# Altium schematic sheet 10_RS232_1.SchDoc
size A3
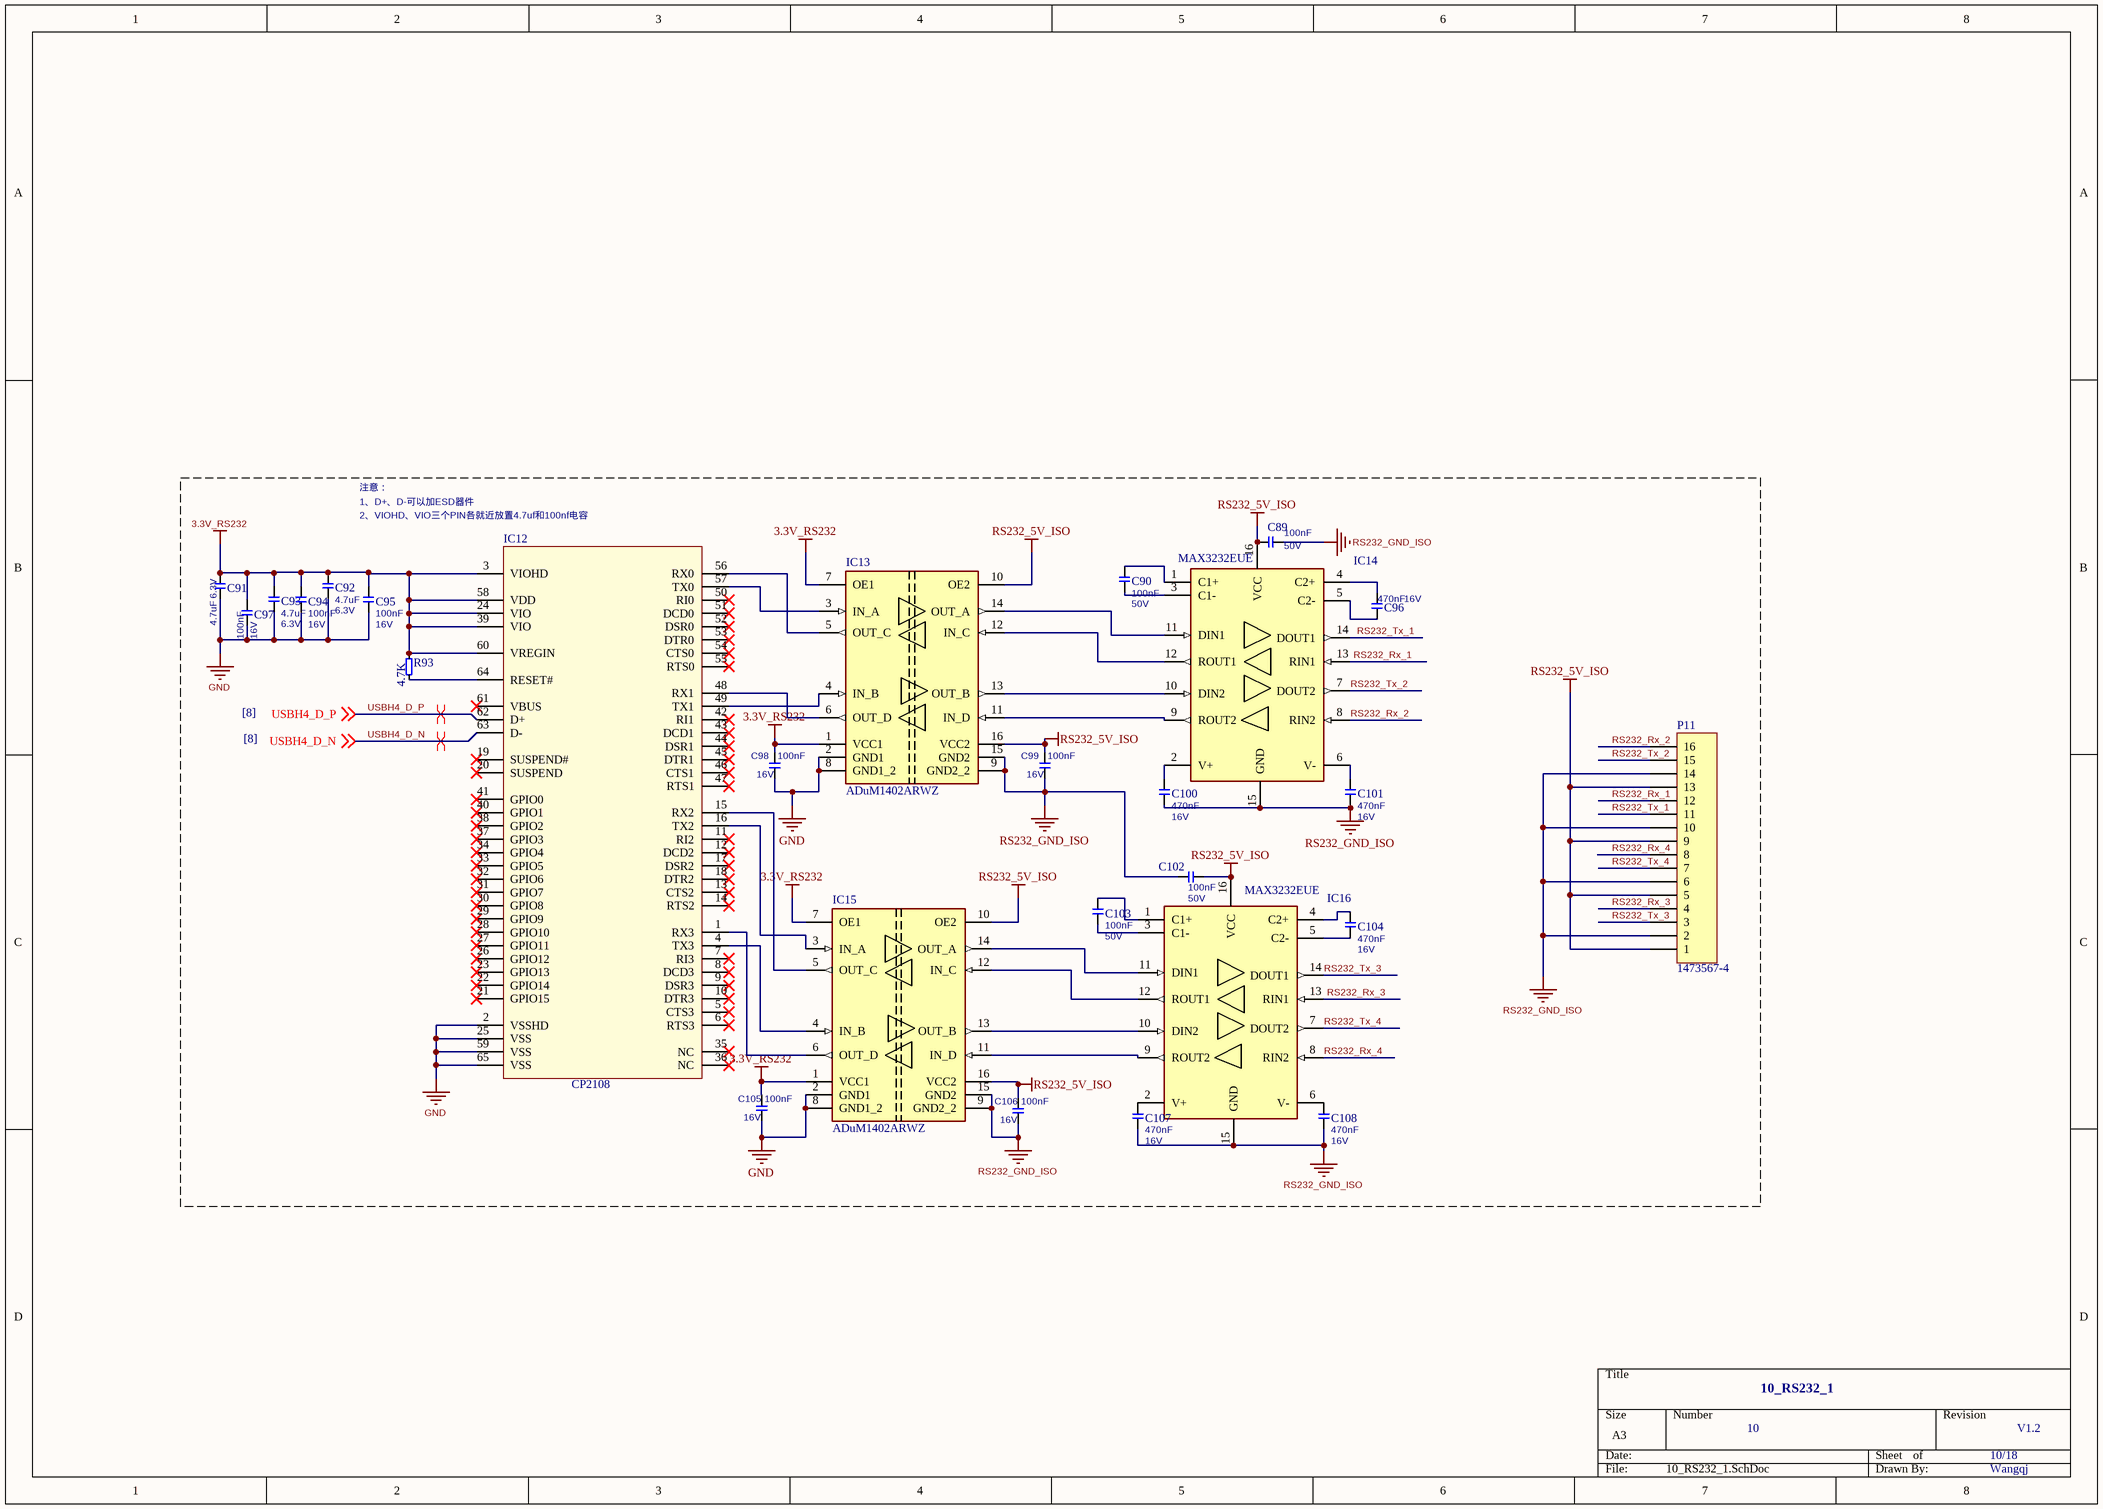
[diagram p0: 10_RS232_1.SchDoc]

## Parts
C89  Rating: 50V  [T_CAPC0603X33N]  (hidden comment: 100nF)
C90  Rating: 50V  [T_CAPC0603X33N]  (hidden comment: 100nF)
C91  Rating: 6.3V  [T_CAPC0603X33N]  (hidden comment: 4.7uF)
C92  Rating: 6.3V  [T_CAPC0603X33N]  (hidden comment: 4.7uF)
C93  Rating: 6.3V  [T_CAPC0603X33N]  (hidden comment: 4.7uF)
C94  Rating: 16V  [T_CAPC0603X33N]  (hidden comment: 100nF)
C95  Rating: 16V  [T_CAPC0603X33N]  (hidden comment: 100nF)
C96  Rating: 16V  [T_CAPC0603X33N]  (hidden comment: 470nF)
C97  Rating: 16V  [T_CAPC0603X33N]  (hidden comment: 100nF)
C98  Rating: 16V  [T_CAPC0603X33N]  (hidden comment: 100nF)
C99  Rating: 16V  [T_CAPC0603X33N]  (hidden comment: 100nF)
C100  Rating: 16V  [T_CAPC0603X33N]  (hidden comment: 470nF)
C101  Rating: 16V  [T_CAPC0603X33N]  (hidden comment: 470nF)
C102  Rating: 50V  [T_CAPC0603X33N]  (hidden comment: 100nF)
C103  Rating: 50V  [T_CAPC0603X33N]  (hidden comment: 100nF)
C104  Rating: 16V  [T_CAPC0603X33N]  (hidden comment: 470nF)
C105  Rating: 16V  [T_CAPC0603X33N]  (hidden comment: 100nF)
C106  Rating: 16V  [T_CAPC0603X33N]  (hidden comment: 100nF)
C107  Rating: 16V  [T_CAPC0603X33N]  (hidden comment: 470nF)
C108  Rating: 16V  [T_CAPC0603X33N]  (hidden comment: 470nF)
IC12  CP2108  [QFN50P900X900X90_HS-65N]
IC13  ADuM1402ARWZ  [T_AD_ADuM1300ARW]
IC14  MAX3232EUE  [LC-TSSOP-16]
IC15  ADuM1402ARWZ  [T_AD_ADuM1300ARW]
IC16  MAX3232EUE  [LC-TSSOP-16]
P11  1473567-4  [147-4]
R93  4.7K  [t_RESC0603X30N]

## Nets
3.3V_RS232: C91.2 C92.2 C93.2 C94.2 C95.2 C97.2 C98.2 C105.2 IC12.3(VIOHD) IC12.24(VIO) IC12.39(VIO) IC12.58(VDD) IC12.60(VREGIN) IC13.1(VCC1) IC13.7(OE1) IC15.1(VCC1) IC15.7(OE1) R93.2
GND: C91.1 C92.1 C93.1 C94.1 C95.1 C97.1 C98.1 C105.1 IC12.2(VSSHD) IC12.25(VSS) IC12.59(VSS) IC12.65(VSS) IC13.2(GND1) IC13.8(GND1_2) IC15.2(GND1) IC15.8(GND1_2)
RS232_5V_ISO: C89.2 C99.2 C102.1 C106.2 IC13.10(OE2) IC13.16(VCC2) IC14.16(VCC) IC15.10(OE2) IC15.16(VCC2) IC16.16(VCC) P11.1 P11.5 P11.9 P11.13
RS232_GND_ISO: C89.1 C99.1 C100.1 C101.1 C102.2 C106.1 C107.1 C108.1 IC13.9(GND2_2) IC13.15(GND2) IC14.15(GND) IC15.9(GND2_2) IC15.15(GND2) IC16.15(GND) P11.2 P11.6 P11.10 P11.14
RS232_Rx_1: IC14.13(RIN1) P11.12
RS232_Rx_2: IC14.8(RIN2) P11.16
RS232_Rx_3: IC16.13(RIN1) P11.4
RS232_Rx_4: IC16.8(RIN2) P11.8
RS232_Tx_1: IC14.14(DOUT1) P11.11
RS232_Tx_2: IC14.7(DOUT2) P11.15
RS232_Tx_3: IC16.14(DOUT1) P11.3
RS232_Tx_4: IC16.7(DOUT2) P11.7
USBH4_D_N: IC12.63(D-) ; off-sheet USBH4_D_N
USBH4_D_P: IC12.62(D+) ; off-sheet USBH4_D_P
NetC90_1: C90.1 IC14.3(C1-)
NetC90_2: C90.2 IC14.1(C1+)
NetC96_1: C96.1 IC14.5(C2-)
NetC96_2: C96.2 IC14.4(C2+)
NetC100_2: C100.2 IC14.2(V+)
NetC101_2: C101.2 IC14.6(V-)
NetC103_1: C103.1 IC16.3(C1-)
NetC103_2: C103.2 IC16.1(C1+)
NetC104_1: C104.1 IC16.5(C2-)
NetC104_2: C104.2 IC16.4(C2+)
NetC107_2: C107.2 IC16.2(V+)
NetC108_2: C108.2 IC16.6(V-)
NetIC12_1: IC12.1(RX3) IC15.6(OUT_D)
NetIC12_4: IC12.4(TX3) IC15.4(IN_B)
NetIC12_15: IC12.15(RX2) IC15.5(OUT_C)
NetIC12_16: IC12.16(TX2) IC15.3(IN_A)
NetIC12_48: IC12.48(RX1) IC13.6(OUT_D)
NetIC12_49: IC12.49(TX1) IC13.4(IN_B)
NetIC12_56: IC12.56(RX0) IC13.5(OUT_C)
NetIC12_57: IC12.57(TX0) IC13.3(IN_A)
NetIC12_64: IC12.64(RESET#) R93.1
NetIC13_11: IC13.11(IN_D) IC14.9(ROUT2)
NetIC13_12: IC13.12(IN_C) IC14.12(ROUT1)
NetIC13_13: IC13.13(OUT_B) IC14.10(DIN2)
NetIC13_14: IC13.14(OUT_A) IC14.11(DIN1)
NetIC15_11: IC15.11(IN_D) IC16.9(ROUT2)
NetIC15_12: IC15.12(IN_C) IC16.12(ROUT1)
NetIC15_13: IC15.13(OUT_B) IC16.10(DIN2)
NetIC15_14: IC15.14(OUT_A) IC16.11(DIN1)

Not connected (* = marked no-connect by the designer): IC12 5(CTS3)* 6(RTS3)* 7(RI3)* 8(DCD3)* 9(DSR3)* 10(DTR3)* 11(RI2)* 12(DCD2)* 13(CTS2)* 14(RTS2)* 17(DSR2)* 18(DTR2)* 19(SUSPEND#)* 20(SUSPEND)* 21(GPIO15)* 22(GPIO14)* 23(GPIO13)* 26(GPIO12)* 27(GPIO11)* 28(GPIO10)* 29(GPIO9)* 30(GPIO8)* 31(GPIO7)* 32(GPIO6)* 33(GPIO5)* 34(GPIO4)* 35(NC)* 36(NC)* 37(GPIO3)* 38(GPIO2)* 40(GPIO1)* 41(GPIO0)* 42(RI1)* 43(DCD1)* 44(DSR1)* 45(DTR1)* 46(CTS1)* 47(RTS1)* 50(RI0)* 51(DCD0)* 52(DSR0)* 53(DTR0)* 54(CTS0)* 55(RTS0)* 61(VBUS)*

## Layout directives
differential pair: USBH4_D_N, USBH4_D_P

## Notes on the sheet
- 注意：
- 1、D+、D-可以加ESD器件
- 2、VIOHD、VIO三个PIN各就近放置4.7uf和100nf电容
- [8]
- 10_RS232_1
- 10
- 10/18
- V1.2
- Wangqj

## Library data of the parts
C89 C90 C102 C103 = C-X7R-100nF-50V-20%-0603: Capacitor Ceramic X7R 100nF 50V 20% 0603; Tolerance: 20%; Type: X7R; Value: 100nF
C91-C93 = C-4.7uF-6.3V-20%-0603-X5R: Capacitor Ceramic X5R 4.7uF 6.3V 20% 0603; Tolerance: 20%; Type: X5R; Value: 4.7uF
C94 C95 C97 = C-100nF-16V-10%-0603-X7R: Capacitor Ceramic X7R 100nF 16V 10% 0603; Tolerance: 10%; Type: X7R; Value: 100nF
C96 C100 C101 C104 C107 C108 = C-X7R-470nF-16V-10%-0603: Capacitor Ceramic X7R 470nF 16V 10% 0603; Type: X7R; Tolerance: 10%; Value: 470nF
C98 C99 C105 C106 = C-X7R-100nF-16V-10%-0603: Capacitor Ceramic X7R 100nF 16V 10% 0603; Tolerance: 10%; Type: X7R; Value: 100nF
IC12 = IC-SILICON-CP2108: Single-Chip USB To Quad UART Bridge; Manufacturer Name: SILICON LABS; Manucfacturer Part NO.: CP2108
IC13 IC15 = IC-AD-ADuM1402ARWZ: Digital Isolator
IC14 IC16 = IC-MAXIM-MAX3232: RS232
P11 = MHDR1X16: 泰科4P端子; LatestRevisionDate: 17-Jul-2002; LatestRevisionNote: Re-released for DXP Platform.; Publisher: Altium Limited
R93 = R-4.7kR-63mW-5%-0603: Resistor 4.7 Kohm 63mW 5% 0603; Value: 4.7KR; Rating: 63mW; Tolerance: 5%